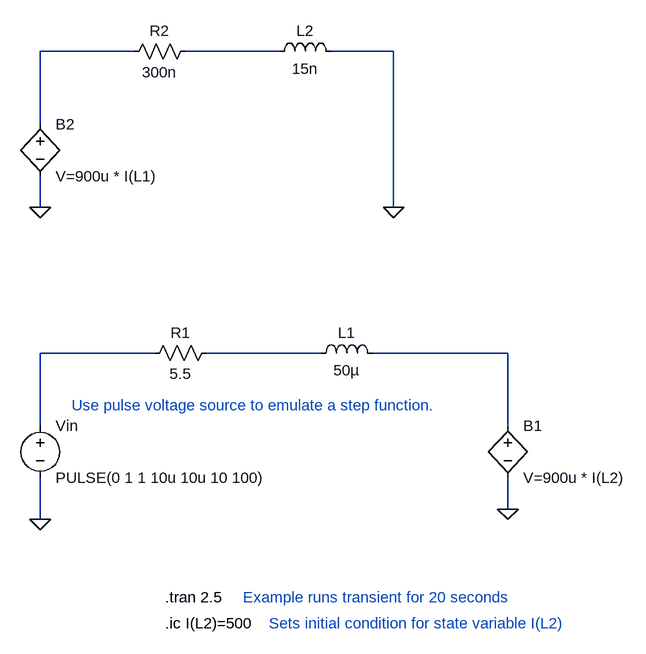
[diagram p0: schematic ol_model.asc]
ol_model.asc, the LTspice schematic file:
Version 4
SHEET 1 1604 776
WIRE 416 -144 272 -144
WIRE 640 -144 496 -144
WIRE 816 -144 720 -144
WIRE 272 -32 272 -144
WIRE 272 96 272 48
WIRE 816 96 816 -144
WIRE 448 320 272 320
WIRE 704 320 528 320
WIRE 992 320 784 320
WIRE 272 432 272 320
WIRE 992 432 992 320
WIRE 992 560 992 512
WIRE 272 576 272 512
FLAG 272 576 0
FLAG 992 560 0
FLAG 272 96 0
FLAG 816 96 0
SYMBOL voltage 272 416 R0
WINDOW 123 0 0 Left 0
WINDOW 39 0 0 Left 0
SYMATTR InstName Vin
SYMATTR Value PULSE(0 1 1 10u 10u 10 100)
SYMBOL res 432 336 R270
WINDOW 0 32 56 VTop 2
WINDOW 3 0 56 VBottom 2
SYMATTR InstName R1
SYMATTR Value 5.5
SYMBOL ind 688 336 R270
WINDOW 0 32 56 VTop 2
WINDOW 3 5 56 VBottom 2
SYMATTR InstName L1
SYMATTR Value 50µ
SYMATTR SpiceLine Rser=0
SYMBOL bv 992 416 R0
SYMATTR InstName B1
SYMATTR Value V=900u * I(L2)
SYMBOL bv 272 -48 R0
SYMATTR InstName B2
SYMATTR Value V=900u * I(L1)
SYMBOL res 512 -160 R90
WINDOW 0 0 56 VBottom 2
WINDOW 3 32 56 VTop 2
SYMATTR InstName R2
SYMATTR Value 300n
SYMBOL ind 624 -128 R270
WINDOW 0 32 56 VTop 2
WINDOW 3 5 56 VBottom 2
SYMATTR InstName L2
SYMATTR Value 15n
SYMATTR SpiceLine Rser=0
TEXT 464 696 Left 2 !.tran 2.5
TEXT 464 736 Left 2 !.ic I(L2)=500
TEXT 320 400 Left 2 ;Use pulse voltage source to emulate a step function.
TEXT 584 696 Left 2 ;Example runs transient for 20 seconds
TEXT 624 736 Left 2 ;Sets initial condition for state variable I(L2)

The netlist it stands for:
* ol_model.asc
Vin N003 0 PULSE(0 1 1 10u 10u 10 100)
R1 N003 N004 5.5
L1 N004 N005 50µ Rser=0
B1 N005 0 V=900u * I(L2)
B2 N001 0 V=900u * I(L1)
R2 N002 N001 300n
L2 N002 0 15n Rser=0
.tran 2.5
.ic I(L2)=500
* Use pulse voltage source to emulate a step function.
* Example runs transient for 20 seconds
* Sets initial condition for state variable I(L2)
.backanno
.end